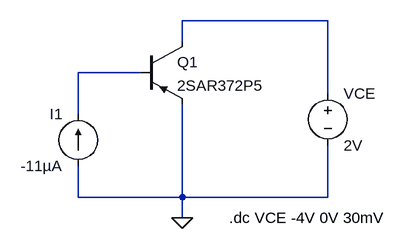
[diagram p0: schematic Fig2.asc]
Fig2.asc, the LTspice schematic file:
Version 4
SHEET 1 956 680
WIRE 688 208 464 208
WIRE 464 240 464 208
WIRE 400 288 304 288
WIRE 688 320 688 208
WIRE 304 352 304 288
WIRE 304 480 304 432
WIRE 464 480 464 336
WIRE 464 480 304 480
WIRE 688 480 688 400
WIRE 688 480 464 480
WIRE 464 512 464 480
FLAG 464 512 0
SYMBOL pnp 400 240 R0
SYMATTR InstName Q1
SYMATTR Value 2SAR372P5
SYMBOL Voltage 688 304 R0
SYMATTR InstName VCE
SYMATTR Value 2V
SYMBOL current 304 432 R180
WINDOW 0 24 80 Left 2
WINDOW 3 24 0 Left 2
SYMATTR InstName I1
SYMATTR Value -11µA
TEXT 536 512 Left 2 !.dc VCE -4V 0V 30mV

The netlist it stands for:
* Fig2.asc
Q1 N001 N002 0 0 2SAR372P5
VCE N001 0 2V
I1 0 N002 -11µA
.model NPN NPN
.model PNP PNP
.lib standard.bjt
.dc VCE -4V 0V 30mV
.backanno
.end